# Altium schematic sheet Sheet2.SchDoc
size A
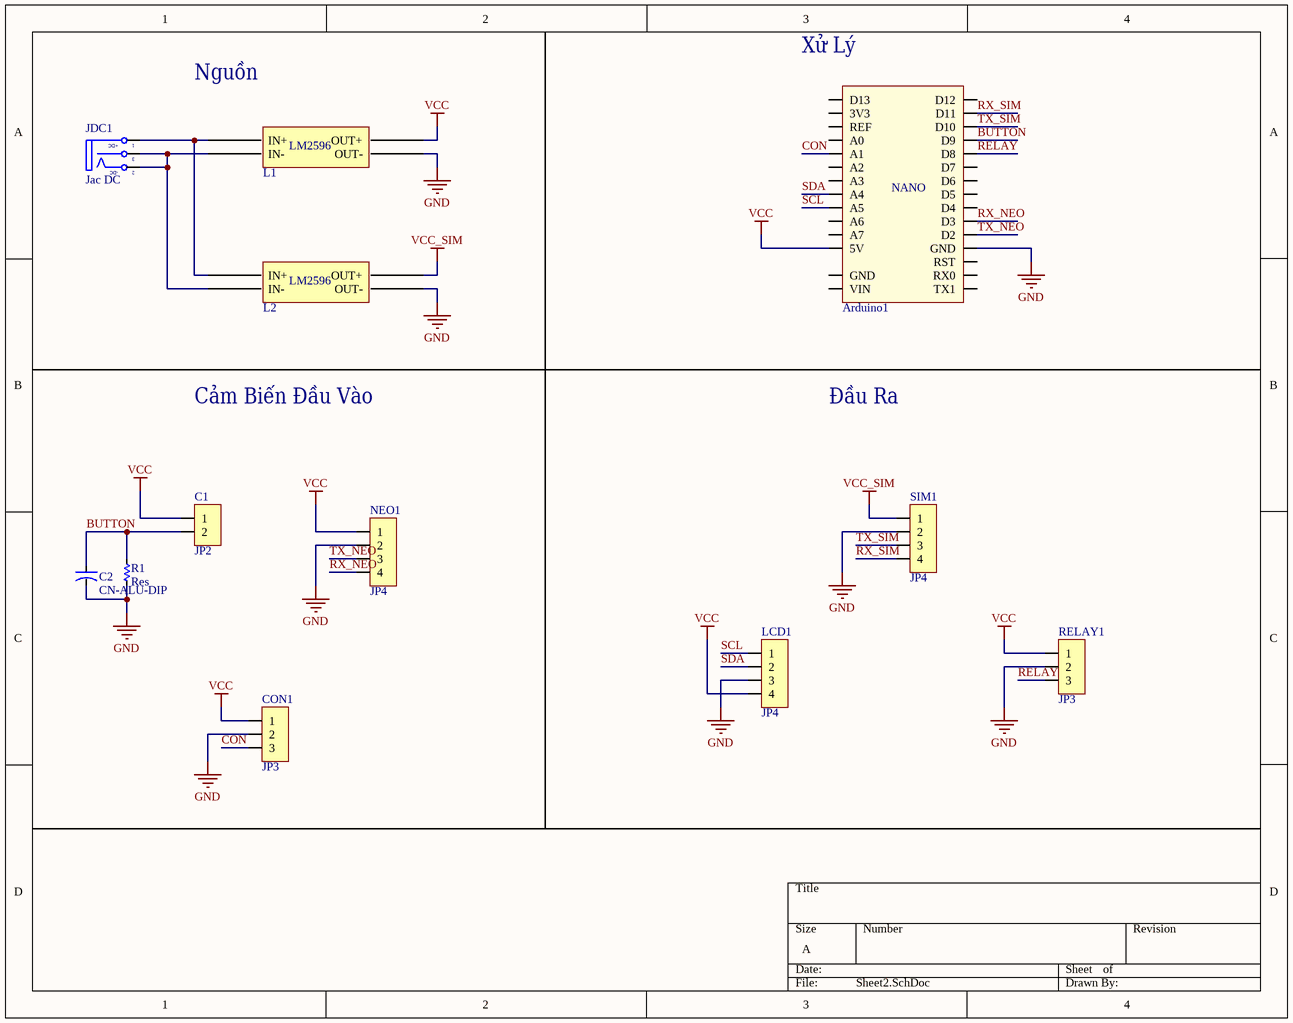
[diagram p0: Sheet2.SchDoc]

## Parts
Arduino1  Arduino Nano  [Arduino Nano]  (value not drawn)
C1  JP2  [JP2-C1T]
C2  CN-ALU-DIP  [CA-ALU-2.54]
CON1  JP3  [JP3-C1T]
JDC1  Jac DC  [DC0]
L1  BUCK_LM2596  [BUCK_LM2596]  (value not drawn)
L2  BUCK_LM2596  [BUCK_LM2596]  (value not drawn)
LCD1  JP4  [JP4-C1T]
NEO1  JP4  [JP4-C1T]
R1  Res  [RES-1/4W]
RELAY1  JP3  [JP3-C1T]
SIM1  JP4  [JP4-C1T]

## Nets
GND: Arduino1.GND C2.2 CON1.2 L1.3(OUT-) L2.3(OUT-) LCD1.3 NEO1.2 R1.2 RELAY1.2 SIM1.2
VCC: Arduino1.5V C1.1 CON1.1 L1.4(OUT+) LCD1.4 NEO1.1 RELAY1.1
VCC_SIM: L2.4(OUT+) SIM1.1
BUTTON: Arduino1.D9 C1.2 C2.1 R1.1
CON: Arduino1.A1 CON1.3
RELAY: Arduino1.D8 RELAY1.3
RX_NEO: Arduino1.D3 NEO1.4
RX_SIM: Arduino1.D11 SIM1.4
SCL: Arduino1.A5 LCD1.1
SDA: Arduino1.A4 LCD1.2
TX_NEO: Arduino1.D2 NEO1.3
TX_SIM: Arduino1.D10 SIM1.3
NetJDC1_1: JDC1.1(T) L1.1(IN+) L2.1(IN+)
NetJDC1_2: JDC1.2(TN) JDC1.3(S) L1.2(IN-) L2.2(IN-)

Not connected (* = marked no-connect by the designer): Arduino1 3V3 A0 A2 A3 A6 A7 D4 D5 D6 D7 D12 D13 REF RST RX0 TX1 VIN

## Notes on the sheet
- Nguồn
- (near Arduino1) Xử Lý
- Cảm Biến Đầu Vào
- Đầu Ra
- (in symbol Arduino Nano) NANO
- (in symbol BUCK_LM2596) LM2596
- (in symbol DCIN) +DC; -DC

## Library data of the parts
Arduino1 = Arduino Nano: Value: Cau 1A
C1 = JP2: WR-PHD 2.54 mm Angled Socket Header; Manufacturer: W¨¹rth Elektronik eiSos GmbH; partNo: 613002143121; ComponentLink1 Description: Manufacturer; ComponentLink2 Description: Datasheet; NoPins: 02; Created Date: 29 March 2013; ComponentLink1URL: http://www.we-online.com; ComponentLink2URL: http://katalog.we-online.de/em/datasheet/6130xx143121.pdf; Created by: Karrer Zheng
C2 = CN-ALU-DIP: Capacitor (Semiconductor SIM Model); Value: 104; LatestRevisionDate: 17-Jul-2002; LatestRevisionNote: Re-released for DXP Platform.; PackageReference: C1206; Publisher: Altium Limited
CON1 RELAY1 = JP3: WR-PHD 2.54 mm Angled Socket Header; Manufacturer: W¨¹rth Elektronik eiSos GmbH; partNo: 613003143121; ComponentLink1 Description: Manufacturer; ComponentLink2 Description: Datasheet; NoPins: 03; Created Date: 29 March 2013; ComponentLink1URL: http://www.we-online.com; ComponentLink2URL: http://katalog.we-online.de/em/datasheet/6130xx143121.pdf; Created by: Karrer Zheng
JDC1 = DCIN: Jac DC input; Value: Jac DC
LCD1 NEO1 SIM1 = JP4: WR-PHD 2.54 mm Angled Socket Header; Manufacturer: W¨¹rth Elektronik eiSos GmbH; partNo: 613004143121; ComponentLink1 Description: Manufacturer; ComponentLink2 Description: Datasheet; NoPins: 04; Created Date: 29 March 2013; ComponentLink1URL: http://www.we-online.com; ComponentLink2URL: http://katalog.we-online.de/em/datasheet/6130xx143121.pdf; Created by: Karrer Zheng
R1 = Res: Manufacturer: Generic Components; Class: Passive; SubClass: R; Published: 08/06/2000; Publisher: Altium Hobart Technology Centre